# Altium project Wireless_Receiver.PrjPcb
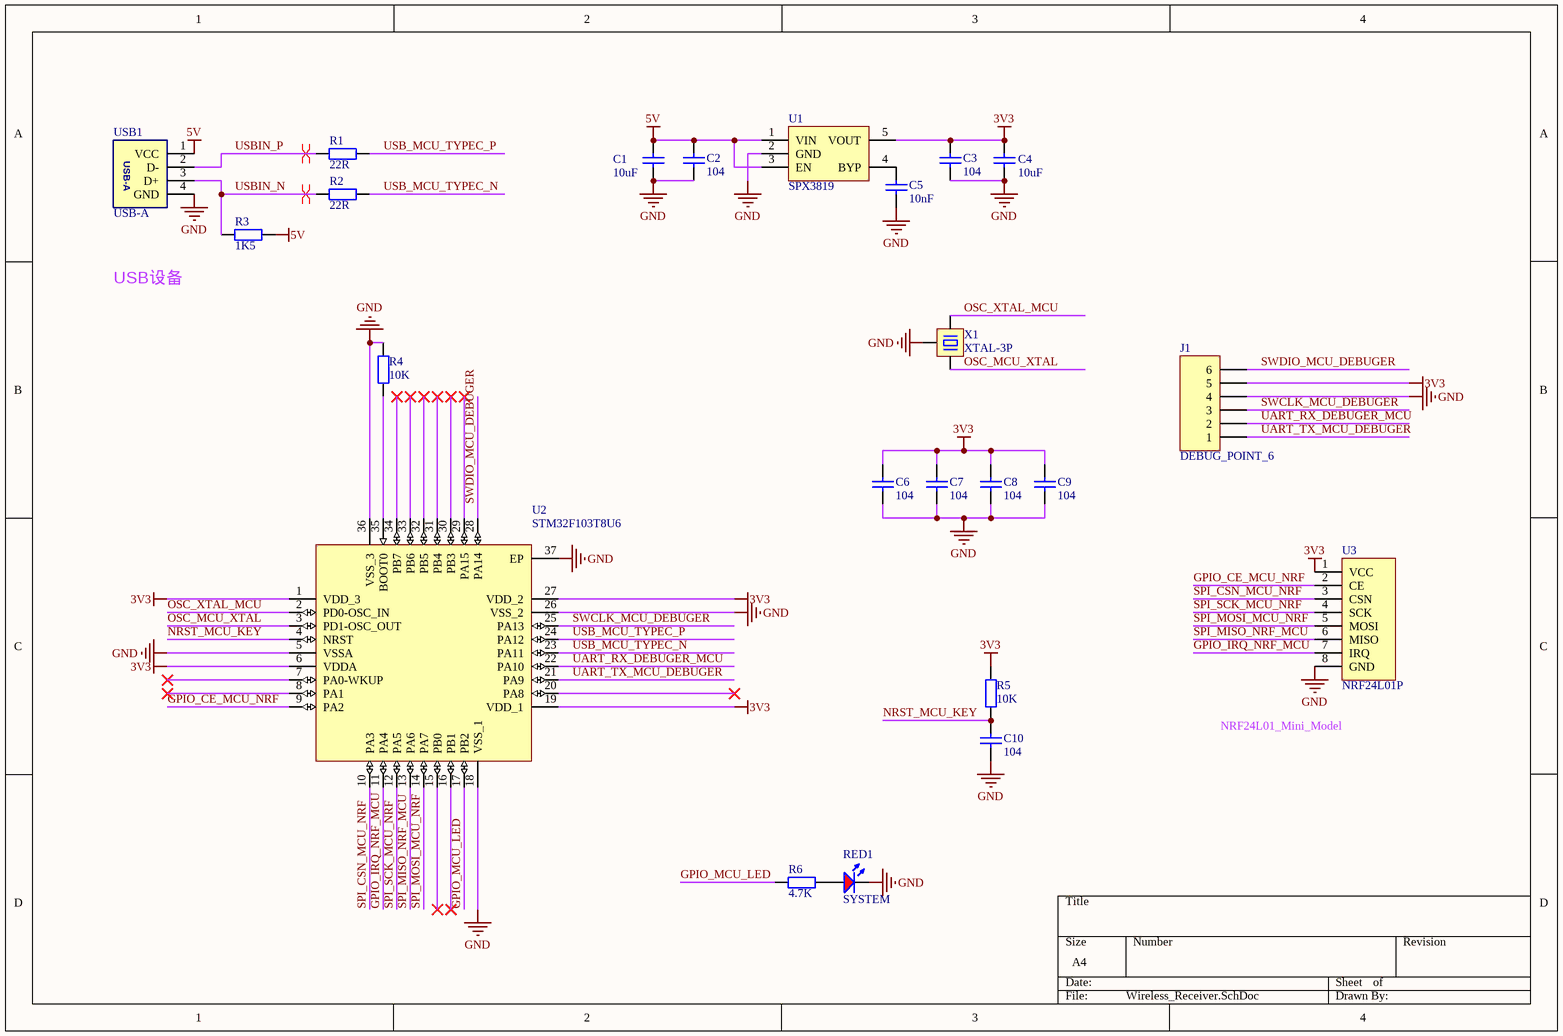
[diagram p0: Wireless_Receiver.SchDoc]
1 sheet, 23 parts. Net scope: global (net labels, ports and power ports of the same name join across sheets).
Board file: Wireless_Receiver.PcbDoc

## Sheet Wireless_Receiver.SchDoc
size A4

### Parts
C1  10uF  [Cap-0603-M]
C2  104  [Cap-0402-M]
C3  104  [Cap-0402-M]
C4  10uF  [Cap-0603-M]
C5  10nF  [Cap-0402-M]
C6  104  [Cap-0402-M]
C7  104  [Cap-0402-M]
C8  104  [Cap-0402-M]
C9  104  [Cap-0402-M]
C10  104  [Cap-0402-M]
J1  DEBUG_POINT_6  [DEBUG_POINT_6]
R1  22R  [Res-0402-M]
R2  22R  [Res-0402-M]
R3  1K5  [Res-0402-M]
R4  10K  [Res-0402-M]
R5  10K  [Res-0402-M]
R6  4.7K  [Res-0402-M]
RED1  SYSTEM  [LED_0603_R]
U1  SPX3819  [SOT23-5]
U2  STM32F103T8U6  [STM-VFQFPN36_L _2]
U3  NRF24L01P  [NRF24L01P]
USB1  USB-A  [USB_A/P_B]
X1  XTAL-3P  [OSC 3213-3P]

### Nets
3V3: C3.2 C4.2 C6.2 C7.2 C8.2 C9.2 J1.5 R5.2 U1.5(VOUT) U2.1(VDD_3) U2.6(VDDA) U2.19(VDD_1) U2.27(VDD_2) U3.1(VCC)
5V: C1.2 C2.2 R3.2 U1.1(VIN) U1.3(EN) USB1.1(VCC)
GND: C1.1 C2.1 C3.1 C4.1 C5.1 C6.1 C7.1 C8.1 C9.1 C10.1 J1.4 R4.2 RED1.2(K) U1.2(GND) U2.5(VSSA) U2.18(VSS_1) U2.26(VSS_2) U2.36(VSS_3) U2.37(EP) U3.8(GND) USB1.4(GND) X1.2
GPIO_CE_MCU_NRF: U2.9(PA2) U3.2(CE)
GPIO_IRQ_NRF_MCU: U2.11(PA4) U3.7(IRQ)
GPIO_MCU_LED: R6.2 U2.17(PB2)
NRST_MCU_KEY: C10.2 R5.1 U2.4(NRST)
OSC_MCU_XTAL: U2.3(PD1-OSC_OUT) X1.3
OSC_XTAL_MCU: U2.2(PD0-OSC_IN) X1.1
SPI_CSN_MCU_NRF: U2.10(PA3) U3.3(CSN)
SPI_MISO_NRF_MCU: U2.13(PA6) U3.6(MISO)
SPI_MOSI_MCU_NRF: U2.14(PA7) U3.5(MOSI)
SPI_SCK_MCU_NRF: U2.12(PA5) U3.4(SCK)
SWCLK_MCU_DEBUGER: J1.3 U2.25(PA13)
SWDIO_MCU_DEBUGER: J1.6 U2.28(PA14)
UART_RX_DEBUGER_MCU: J1.2 U2.22(PA10)
UART_TX_MCU_DEBUGER: J1.1 U2.21(PA9)
USB_MCU_TYPEC_N: R2.2 U2.23(PA11)
USB_MCU_TYPEC_P: R1.2 U2.24(PA12)
USBIN_N: R2.1 R3.1 USB1.3(D+)
USBIN_P: R1.1 USB1.2(D-)
NetC5_2: C5.2 U1.4(BYP)
NetR4_1: R4.1 U2.35(BOOT0)
NetR6_1: R6.1 RED1.1(A)

Not connected (* = marked no-connect by the designer): U2 7(PA0-WKUP)* 8(PA1)* 15(PB0)* 16(PB1)* 20(PA8)* 29(PA15)* 30(PB3)* 31(PB4)* 32(PB5)* 33(PB6)* 34(PB7)*

### Layout directives
differential pair: USBIN_N, USBIN_P

### Notes on the sheet
- USB设备
- NRF24L01_Mini_Model

### Library data of the parts
C1-C10 = CAP: 贴片陶瓷电容
R1-R6 = RES: 贴片电阻
RED1 = LED_SMD_RED: 发光二极管; ComponentLink1Description: 供应商链接; ComponentLink1URL: http://www.szlcsc.com/product/details_2659.html; Package: 0603; Supplier: LC; SuppliersPartNumber: C2286
U2 = STM32F103T8U6: ARM Cortex-M3 32-bit MCU, 64 KB Flash, 20 KB Internal RAM, 26 I/Os, 36-pin VFQFPN, -40 to 85 degC, Tray; A/D Converter: 2x12-bit (10 Channel); FLASH Size (Prog) (kB): 64; I/Os (High Current): 26; Internal RAM Size (kB): 20; Operating Frequency(F) (Processor speed) (MHz): 72; Supply Voltage(Vcc) min (V): 2; DatasheetVersion: Rev. 16; PackageVersion: Rev. 16, 08/2013; PackageReference: VFQFPN36; PackageDescription: 36-Pin Quad Flat No-Lead, 6 x 6 x 1.0 mm Body, 0.5 mm Pitch, Exposed Pad; Supplier 1: Digi-Key; Supplier Part Number 1: 497-11532-ND; Supplier 2: Farnell; Supplier Part Number 2: 1606329; Supplier 3: Newark; Supplier Part Number 3: 11N8298; Supplier 4: Mouser; Supplier Part Number 4: 511-STM32F103T8U6; Core: ARM Cortex-M3; Packing: Tray; Mounting Technology: Surface Mount; PartNumber: STM32F103T8U6; ComponentLink1Description: Manufacturer URL; ComponentLink1URL: http://www.st.com/web/en/home.html; ComponentLink2Description: Datasheet; ComponentLink2URL: http://www.st.com/st-web-ui/static/active/en/resource/technical/document/datasheet/CD00161566.pdf; ComponentLink3Description: Package Specification; ComponentLink3URL: http://www.st.com/st-web-ui/static/active/en/resource/technical/document/datasheet/CD00161561.pdf
U3 = NRF24L01P: 2.4G无线模块
X1 = XTAL-3P: 3脚无源晶振带电容